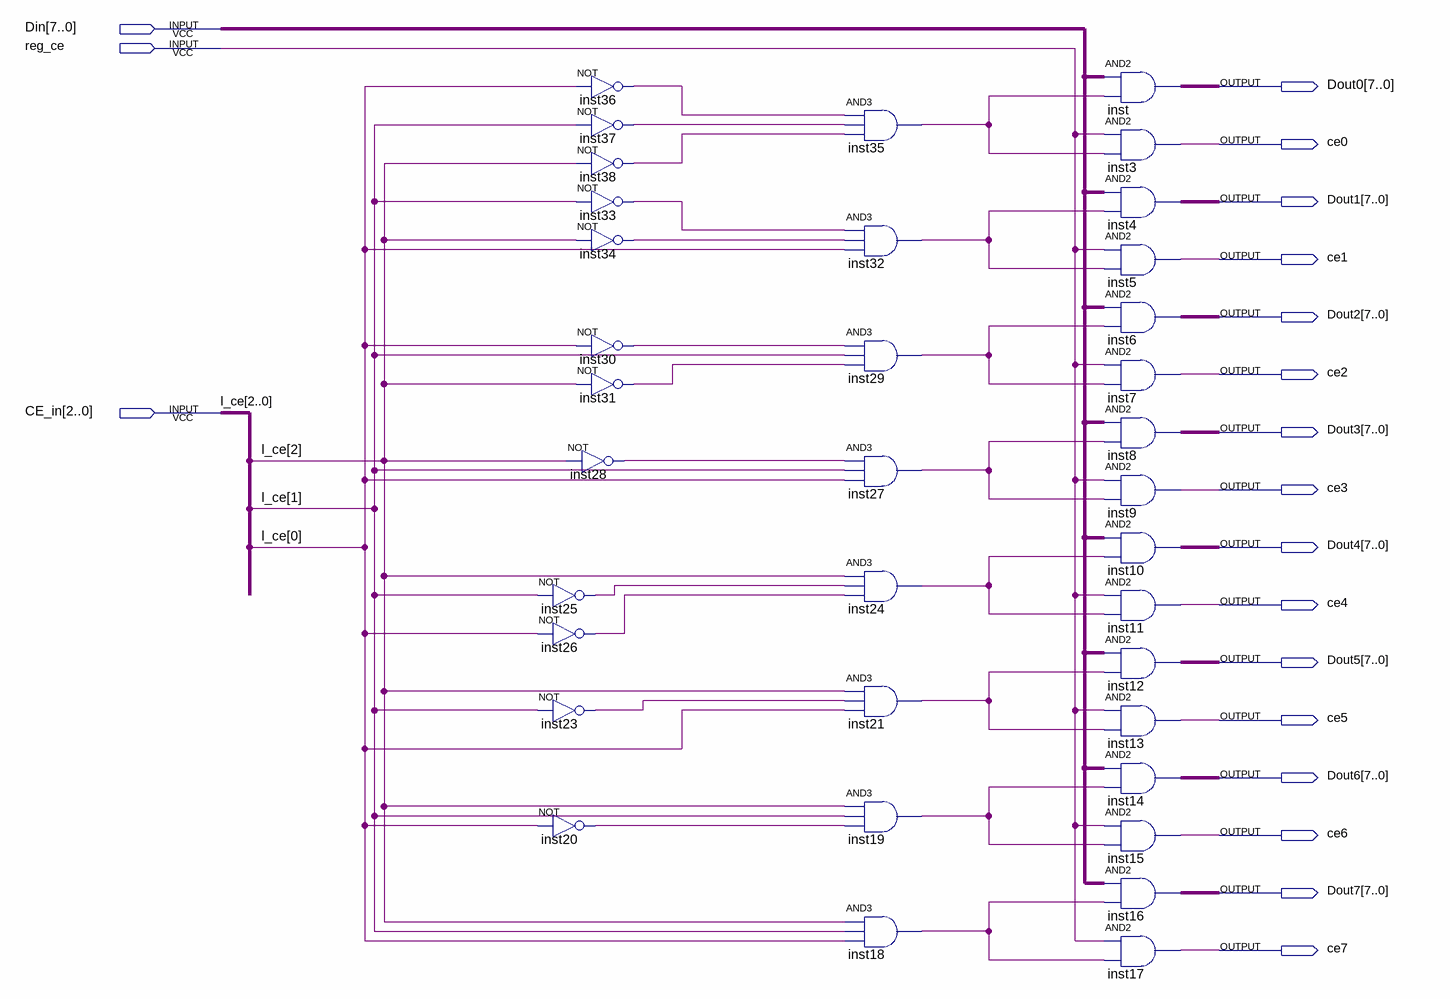
[diagram p0: schematic sheet]
// Quartus schematic demux.bdf as structural Verilog: 36 symbols, 19 pins
module demux (
  input  [7:0] Din,
  input  reg_ce,
  input  [2:0] CE_in,
  output [7:0] Dout0,
  output ce0,
  output [7:0] Dout1,
  output ce1,
  output [7:0] Dout2,
  output ce2,
  output [7:0] Dout3,
  output ce3,
  output [7:0] Dout4,
  output ce4,
  output [7:0] Dout5,
  output ce5,
  output [7:0] Dout6,
  output ce6,
  output [7:0] Dout7,
  output ce7
);

  wire inst18_out, inst19_out, inst20_out, inst21_out, inst23_out, inst24_out, inst25_out, inst26_out,
       inst27_out, inst28_out, inst29_out, inst30_out, inst31_out, inst32_out, inst33_out, inst34_out,
       inst35_out, inst36_out, inst37_out, inst38_out;

  not inst36 (inst36_out, CE_in[0]);
  not inst37 (inst37_out, CE_in[1]);
  not inst38 (inst38_out, CE_in[2]);
  not inst33 (inst33_out, CE_in[1]);
  not inst34 (inst34_out, CE_in[2]);
  not inst30 (inst30_out, CE_in[0]);
  not inst31 (inst31_out, CE_in[2]);
  not inst28 (inst28_out, CE_in[2]);
  not inst25 (inst25_out, CE_in[1]);
  not inst26 (inst26_out, CE_in[0]);
  not inst23 (inst23_out, CE_in[1]);
  not inst20 (inst20_out, CE_in[0]);
  and inst35 (inst35_out, inst36_out, inst37_out, inst38_out);
  and inst32 (inst32_out, inst33_out, inst34_out, CE_in[0]);
  and inst29 (inst29_out, inst30_out, CE_in[1], inst31_out);
  and inst27 (inst27_out, inst28_out, CE_in[1], CE_in[0]);
  and inst24 (inst24_out, CE_in[2], inst25_out, inst26_out);
  and inst21 (inst21_out, CE_in[2], inst23_out, CE_in[0]);
  and inst19 (inst19_out, CE_in[2], CE_in[1], inst20_out);
  and inst18 (inst18_out, CE_in[2], CE_in[1], CE_in[0]);
  assign Dout0 = Din & {8{inst35_out}};  // AND2 inst, 8 bits wide
  and inst3 (ce0, reg_ce, inst35_out);
  assign Dout1 = Din & {8{inst32_out}};  // AND2 inst4, 8 bits wide
  and inst5 (ce1, reg_ce, inst32_out);
  assign Dout2 = Din & {8{inst29_out}};  // AND2 inst6, 8 bits wide
  and inst7 (ce2, reg_ce, inst29_out);
  assign Dout3 = Din & {8{inst27_out}};  // AND2 inst8, 8 bits wide
  and inst9 (ce3, reg_ce, inst27_out);
  assign Dout4 = Din & {8{inst24_out}};  // AND2 inst10, 8 bits wide
  and inst11 (ce4, reg_ce, inst24_out);
  assign Dout5 = Din & {8{inst21_out}};  // AND2 inst12, 8 bits wide
  and inst13 (ce5, reg_ce, inst21_out);
  assign Dout6 = Din & {8{inst19_out}};  // AND2 inst14, 8 bits wide
  and inst15 (ce6, reg_ce, inst19_out);
  assign Dout7 = Din & {8{inst18_out}};  // AND2 inst16, 8 bits wide
  and inst17 (ce7, reg_ce, inst18_out);

  // Other names for the same wires on the sheet: l_ce[2:0] = CE_in
endmodule
